# EAGLE design module-si1133 (EAGLE 7.4.0)
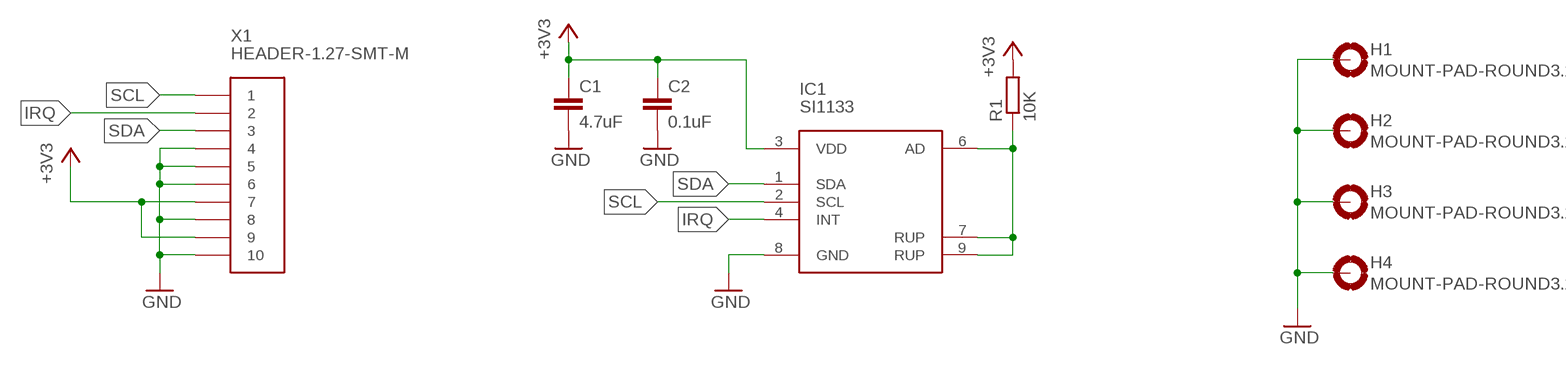
[diagram p0: schematic, sheet 1]

## Parts
C1  4.7uF  C-EUC0805  [C0805]
C2  0.1uF  C-EUC0603  [C0603]
H1  MOUNT-PAD-ROUND3.2  [3,2-PAD]
H2  MOUNT-PAD-ROUND3.2  [3,2-PAD]
H3  MOUNT-PAD-ROUND3.2  [3,2-PAD]
H4  MOUNT-PAD-ROUND3.2  [3,2-PAD]
IC1  SI1133  [DFN10-2X2]
R1  10K  R-EU_R0603  [R0603]
X1  HEADER-1.27-SMT-M  [HEADER-1.27-SMT-M]

## Nets
+3V3: C1.1 C2.1 IC1.3(VDD) R1.2 X1.7 X1.9
GND: C1.2 C2.2 H1.B3,2(MOUNT) H2.B3,2(MOUNT) H3.B3,2(MOUNT) H4.B3,2(MOUNT) IC1.8(GND) X1.4 X1.5 X1.6 X1.8 X1.10
IRQ: IC1.4(INT) X1.2
N$1: IC1.6(AD) IC1.7(RUP) IC1.9(RUP) R1.1
SCL: IC1.2(SCL) X1.1
SDA: IC1.1(SDA) X1.3

## Library data of the parts
C1 C2 = rcl:C-EU: CAPACITOR, European symbol
H1-H4 = holes:MOUNT-PAD-ROUND: MOUNTING PAD, round
IC1 = light-sensors:SI1133
R1 = rcl:R-EU_: RESISTOR, European symbol
X1 = con-headers:HEADER-1.27-SMT-M

## Board
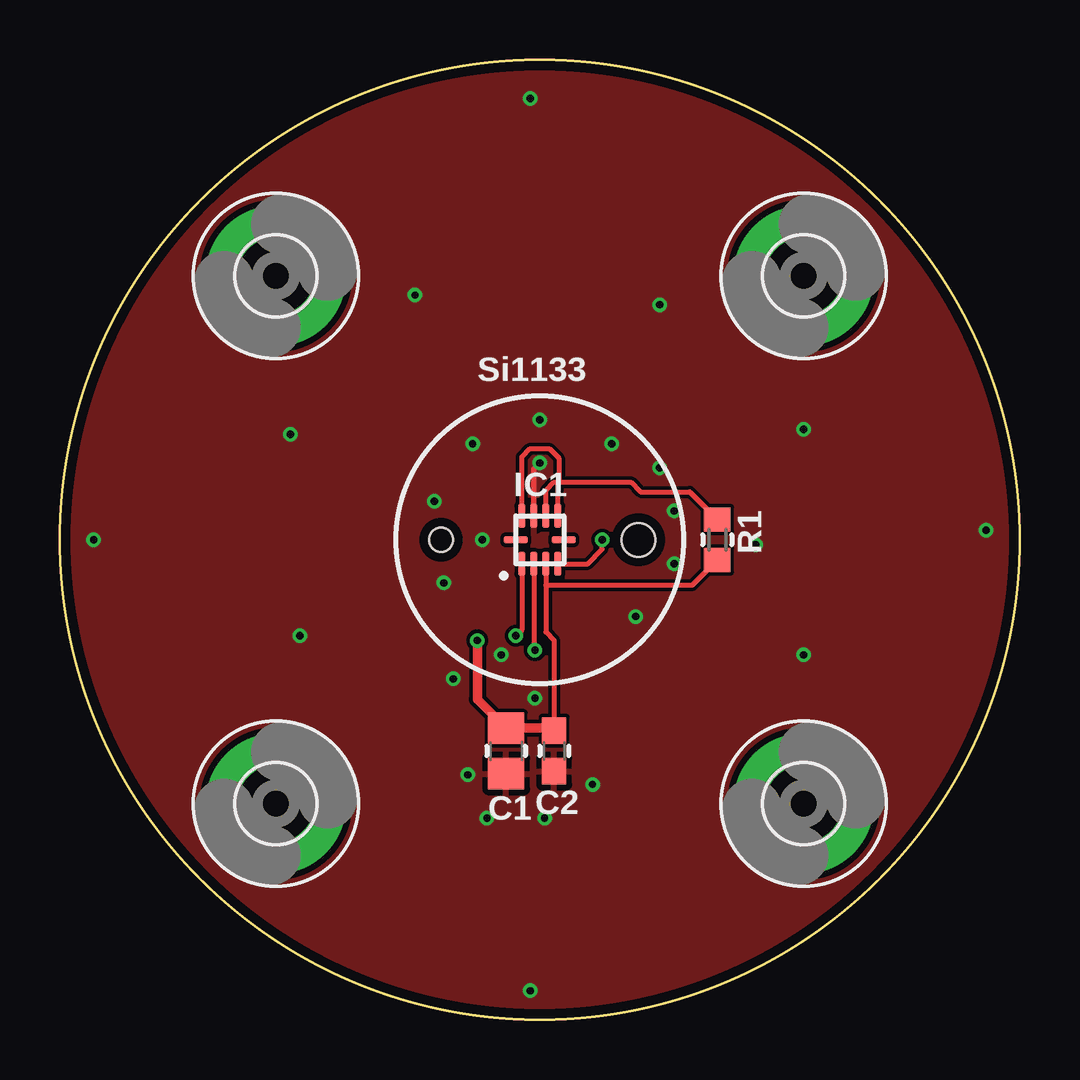
[diagram p1: board, top side]
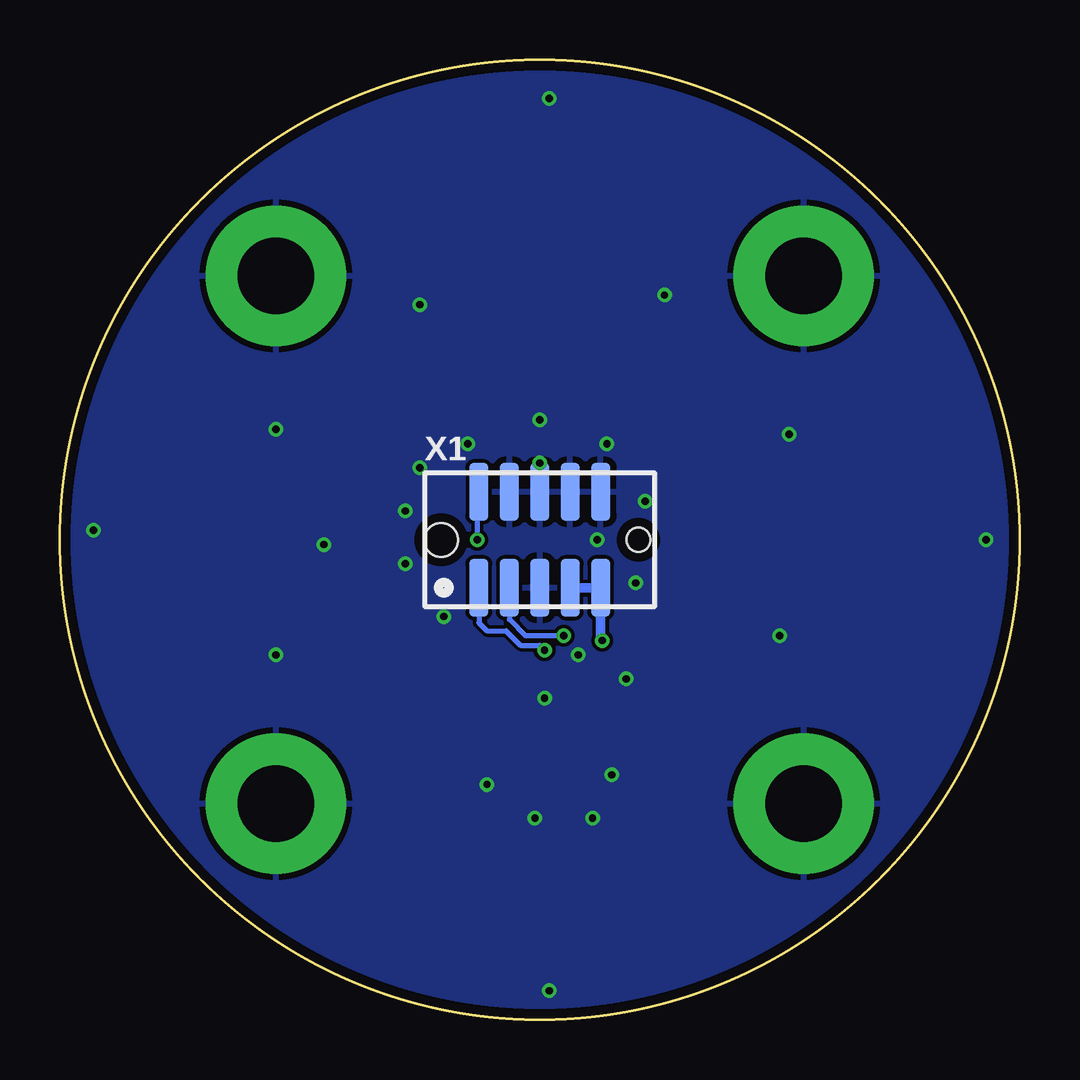
[diagram p2: board, bottom side, seen from below]

Size 40 x 40 mm. Coordinates in mm from the lower left corner, seen from the top.
Outline: circle at 20,20 radius 20
Copper layers (1*16): Top 0.035mm / dielectric 1.5mm / Bottom 0.035mm
Design rules "seeed": minimum track width 0.2mm, minimum drill 0.3mm, track to track 0.15mm, track to pad 0.15mm, pad to pad 0.15mm, via to via 0.15mm, smd to smd 0mil, copper to edge 0.4mm, drill to drill 0.4mm, minimum pad ring 6mil, minimum via ring 6mil, stop-mask expansion 2mil, vias tented up to drill 0.5mm, thermal gap 10mil

### Footprints (pad centres in the part's own frame; a part is rotated, then mirrored left to right if it is on the bottom)
C0805 = smd 1.3 x 1.5: 1 -0.95,0; 2 0.95,0
C0603 = smd 1.1 x 1: 1 -0.85,0; 2 0.85,0
3,2-PAD = drill 3.2 pad 5.842: B3,2 0,0
DFN10-2X2 = smd 1 x 0.3: 1 -1,0.75; 2 -1,0.25; 3 -1,-0.25; 4 -1,-0.75; 6 1,-0.75; 7 1,-0.25; 8 1,0.25; 9 1,0.75 | smd 0.3 x 1: 5 0,-1; 10 0,1
R0603 = smd 1 x 1.1: 1 -0.85,0; 2 0.85,0
HEADER-1.27-SMT-M = smd 0.8 x 2.4: 1 -2.54,-2; 2 -2.54,2; 3 -1.27,-2; 4 -1.27,2; 5 0,-2; 6 0,2; 7 1.27,-2; 8 1.27,2; 9 2.54,-2; 10 2.54,2 | hole 1: 4.115,0 | hole 1.4: -4.115,0

### Placement (x,y rotation side)
C1  18.6,11.2 270 top
C2  20.6,11.2 270 top
H1  31,9 0 top
H2  9,9 0 top
H3  9,31 0 top
H4  31,31 0 top
IC1  20,20 90 top
R1  27.4,20 270 top
X1  20,20 0 bottom

### Tracks (layer width: path | path; a pad name or v marks a point on that pad's centre or on a via)
+3V3  (via drill 0.3)
  Top 0.2: IC1.3 20.25,18.11 | 20.25,18.11 20.25,16.15 20.6,15.8 C2.1 | 20.25,18.11 26.36,18.11 R1.2
  Top 0.4: v17.4,15.8 17.4,13.35 C1.1 20.5,12.15 C2.1
  Bottom 0.4: X1.7 X1.9 17.46,15.86 v17.4,15.8
GND  (via drill 0.3)
  Top 0.2: IC1.8 19.75,22.95 v20,23.2
  Bottom 0.2: v20,23.2 X1.6
  other vias: 19.6,1.2 19.6,38.4 1.4,20 38.6,20.4 17,10.2 17.8,8.4 20.2,8.4 22.2,9.8 19.8,13.4 18.4,15.2 17.2,24 20,25 23,24 25,23 15.6,21.6 16,18.2 17.6,20 25.6,21.2 25.6,19 24,16.8 16.4,14.2 29,19.8 9.6,24.4 10,16 31,15.2 31,24.6 25,29.8 14.8,30.2
  pour Top: 20,0 arc90 40,20 arc90 20,40 arc90 0,20 arc90
  pour Bottom (rank 2): 20,0 arc90 40,20 arc90 20,40 arc90 0,20 arc90
IRQ  (via drill 0.3)
  Top 0.2: IC1.4 22,19 22.6,19.6 v22.6,20
  Bottom 0.2: v22.6,20 22.6,21.94 X1.2
N$1
  Top 0.2: R1.1 26.25,22 24.2,22 23.8,22.4 20.8,22.4 | IC1.7 20.25,22.05 20.6,22.4 20.8,22.4 | IC1.6 20.75,22.35 20.8,22.4 | IC1.9 19.25,23.45 19.6,23.8 20.4,23.8 20.8,23.4 20.8,22.4
SCL  (via drill 0.3)
  Top 0.2: IC1.2 19.75,15.45 v19.8,15.4
  Bottom 0.2: X1.1 22.54,16.54 22.2,16.2 21.4,16.2 20.8,15.6 20,15.6 v19.8,15.4
SDA  (via drill 0.3)
  Top 0.2: IC1.1 19.25,16.25 v19,16
  Bottom 0.2: X1.3 21.27,16.67 20.6,16 v19,16

### Text on the board
tNames: Si1133